# EAGLE design SOIC8 (EAGLE 6.0)
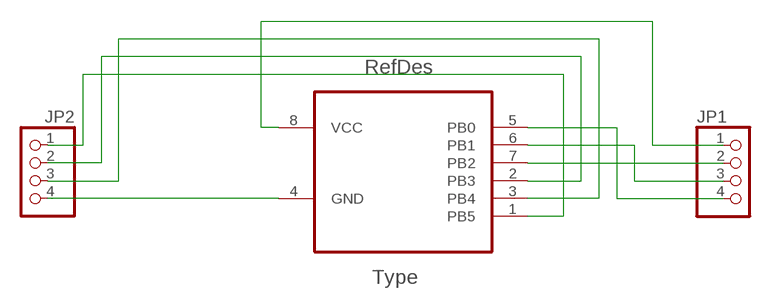
[diagram p0: schematic, sheet 1]

## Parts
JP1  PINHD-1X4  [1X04]
JP2  PINHD-1X4  [1X04]
U1  ATTINY13-20SU  [SOIC127P798X216-8N]

## Nets
N$1: JP2.1 U1.1(PB5)
N$2: JP2.2 U1.2(PB3)
N$3: JP2.3 U1.3(PB4)
N$4: JP2.4 U1.4(GND)
N$5: JP1.4 U1.5(PB0)
N$6: JP1.3 U1.6(PB1)
N$7: JP1.2 U1.7(PB2)
N$8: JP1.1 U1.8(VCC)

## Library data of the parts
JP1 JP2 = pinhead:PINHD-1X4: PIN HEADER
U1 = Atmel-ATTINY13-20SU:ATTINY13-20SU; DESCRIPTION: 8-bit Microcontroller with In-System Programmable Flash; MPN: ATTINY13-20SU; OC_FARNELL: 9171568; OC_NEWARK: 96K6522; PACKAGE: SOIC-8; SUPPLIER: Atmel

## Board
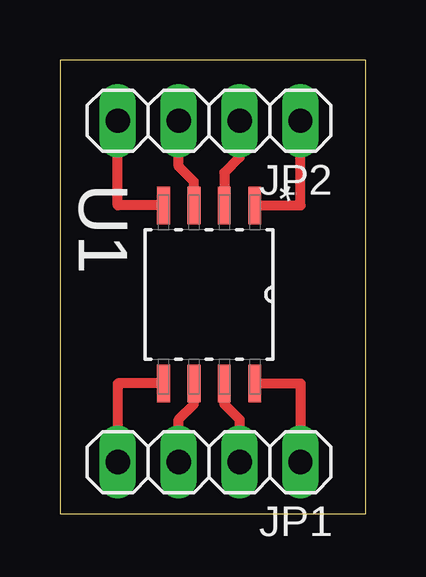
[diagram p1: board, top side]

Size 12.75 x 18.91 mm. Coordinates in mm from the lower left corner, seen from the top.
Outline: 0,0 12.75,0 12.75,18.91 0,18.91 0,0
Copper layers (1*16): Top 0.035mm / dielectric 1.5mm / Bottom 0.035mm
Design rules: minimum track width 10mil, minimum drill 24mil, track to track 8mil, track to pad 8mil, pad to pad 8mil, via to via 8mil, smd to smd 8mil, copper to edge 40mil, drill to drill 8mil, minimum pad ring 10mil, minimum via ring 8mil, stop-mask expansion 4mil, vias tented up to drill 0mil, thermal gap 10mil

### Footprints (pad centres in the part's own frame; a part is rotated, then mirrored left to right if it is on the bottom)
1X04 = drill 1.016 long: 1 -3.81,0; 2 -1.27,0; 3 1.27,0; 4 3.81,0
SOIC127P798X216-8N = smd 1.549 x 0.533: 1 -3.708,1.905; 2 -3.708,0.635; 3 -3.708,-0.635; 4 -3.708,-1.905; 5 3.708,-1.905; 6 3.708,-0.635; 7 3.708,0.635; 8 3.708,1.905

### Placement (x,y rotation side)
JP1  6.22,2.16 180 top
JP2  6.22,16.38 180 top
U1  6.22,9.14 270 top

### Tracks (layer width: path | path; a pad name or v marks a point on that pad's centre or on a via)
N$1
  Top 0.406: U1.1 10.03,12.85 JP2.1
N$2
  Top 0.406: JP2.2 7.49,14.86 6.86,14.22 U1.2
N$3
  Top 0.406: U1.3 5.59,13.84 4.95,14.48 JP2.3
N$4
  Top 0.406: U1.4 2.41,12.85 JP2.4
N$5
  Top 0.406: U1.5 2.41,5.44 JP1.4
N$6
  Top 0.406: JP1.3 4.95,3.94 5.59,4.57 U1.6
N$7
  Top 0.406: U1.7 6.86,4.57 7.49,3.94 JP1.2
N$8
  Top 0.406: U1.8 10.03,5.44 JP1.1